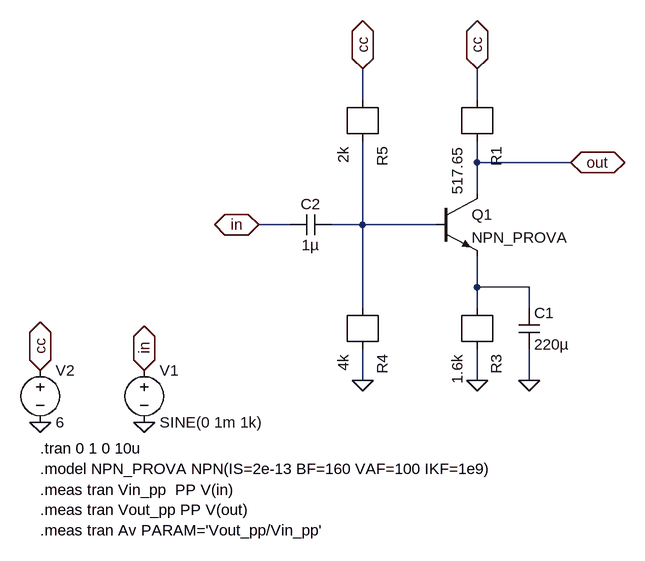
[diagram p0: schematic circuit_lt.asc]
circuit_lt.asc, the LTspice schematic file:
Version 4
SHEET 1 1268 696
WIRE 528 -32 528 -80
WIRE 704 -32 704 -80
WIRE 704 64 704 32
WIRE 848 64 704 64
WIRE 704 112 704 64
WIRE 416 160 368 160
WIRE 528 160 528 32
WIRE 528 160 480 160
WIRE 640 160 528 160
WIRE 704 256 704 208
WIRE 784 256 704 256
WIRE 528 288 528 160
WIRE 704 288 704 256
WIRE 784 288 784 256
WIRE 528 400 528 352
WIRE 704 400 704 352
WIRE 784 400 784 352
FLAG 32 464 0
FLAG 192 464 0
FLAG 32 384 cc
IOPIN 32 384 BiDir
FLAG 192 384 in
IOPIN 192 384 BiDir
FLAG 368 160 in
IOPIN 368 160 BiDir
FLAG 704 400 0
FLAG 528 400 0
FLAG 528 -80 cc
IOPIN 528 -80 BiDir
FLAG 704 -80 cc
IOPIN 704 -80 BiDir
FLAG 784 400 0
FLAG 848 64 out
IOPIN 848 64 BiDir
SYMBOL voltage 192 368 R0
SYMATTR InstName V1
SYMATTR Value SINE(0 1m 1k)
SYMBOL voltage 32 368 R0
SYMATTR InstName V2
SYMATTR Value 6
SYMBOL npn 640 112 R0
SYMATTR InstName Q1
SYMATTR Value NPN_PROVA
SYMBOL r 704 -32 R90
SYMATTR InstName R1
SYMATTR Value 517.65
SYMBOL r 704 288 R90
SYMATTR InstName R3
SYMATTR Value 1.6k
SYMBOL r 528 288 R90
SYMATTR InstName R4
SYMATTR Value 4k
SYMBOL r 528 -32 R90
SYMATTR InstName R5
SYMATTR Value 2k
SYMBOL cap 768 288 R0
SYMATTR InstName C1
SYMATTR Value 220µ
SYMBOL cap 480 144 R90
WINDOW 0 0 32 VBottom 2
WINDOW 3 32 32 VTop 2
SYMATTR InstName C2
SYMATTR Value 1µ
TEXT 32 536 Left 2 !.model NPN_PROVA NPN(IS=2e-13 BF=160 VAF=100 IKF=1e9)
TEXT 32 504 Left 2 !.tran 0 1 0 10u
TEXT 32 568 Left 2 !.meas tran Vin_pp  PP V(in)\n.meas tran Vout_pp PP V(out)\n.meas tran Av PARAM='Vout_pp/Vin_pp'

The netlist it stands for:
* circuit_lt.asc
V1 in 0 SINE(0 1m 1k)
V2 cc 0 6
Q1 out N001 N002 0 NPN_PROVA
R1 out cc 517.65
R3 0 N002 1.6k
R4 0 N001 4k
R5 N001 cc 2k
C1 N002 0 220µ
C2 N001 in 1µ
.model NPN NPN
.model PNP PNP
.lib standard.bjt
.model NPN_PROVA NPN(IS=2e-13 BF=160 VAF=100 IKF=1e9)
.tran 0 1 0 10u
.meas tran Vin_pp  PP V(in)
.meas tran Vout_pp PP V(out)
.meas tran Av PARAM='Vout_pp/Vin_pp'
.backanno
.end